# Altium schematic sheet Sheet1.SchDoc
size A4
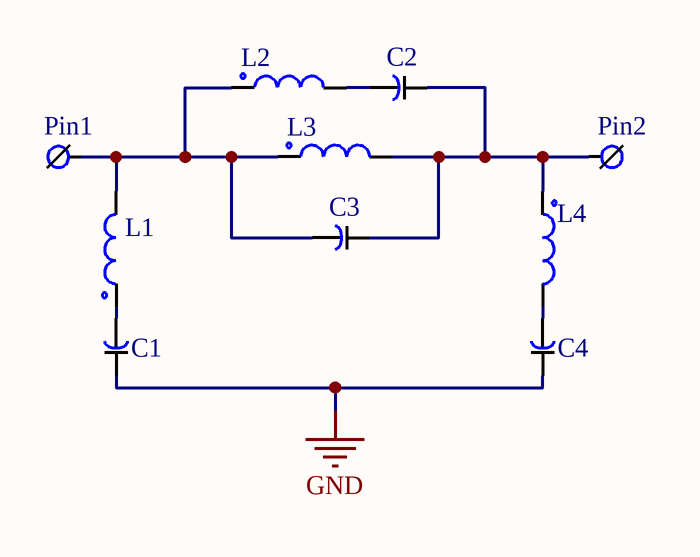
[diagram p0: Sheet1.SchDoc]

## Parts
C1  C1,C4  [C1,C4(0805)]  (value not drawn)
C2  C2  [C2(0603)]  (value not drawn)
C3  C3  [C3(1206)]  (value not drawn)
C4  C1,C4  [C1,C4(0805)]  (value not drawn)
L1  L1,L4,L3  [L1,L4,L3]  (value not drawn)
L2  L2  [L2]  (value not drawn)
L3  L1,L4,L3  [L1,L4,L3]  (value not drawn)
L4  L1,L4,L3  [L1,L4,L3]  (value not drawn)
Pin1  Comment  [Pin]  (value not drawn)
Pin2  Pin  [Pin]  (value not drawn)

## Nets
GND: C1.2 C4.2
NetC1_1: C1.1 L1.1
NetC2_1: C2.1 L2.2
NetC2_2: C2.2 C3.2 L3.2 L4.1 Pin2.1
NetC3_1: C3.1 L1.2 L2.1 L3.1 Pin1.1
NetC4_1: C4.1 L4.2

## Library data of the parts
Pin1 = Pin